# EAGLE schematic main-board (EAGLE 9.6.2)
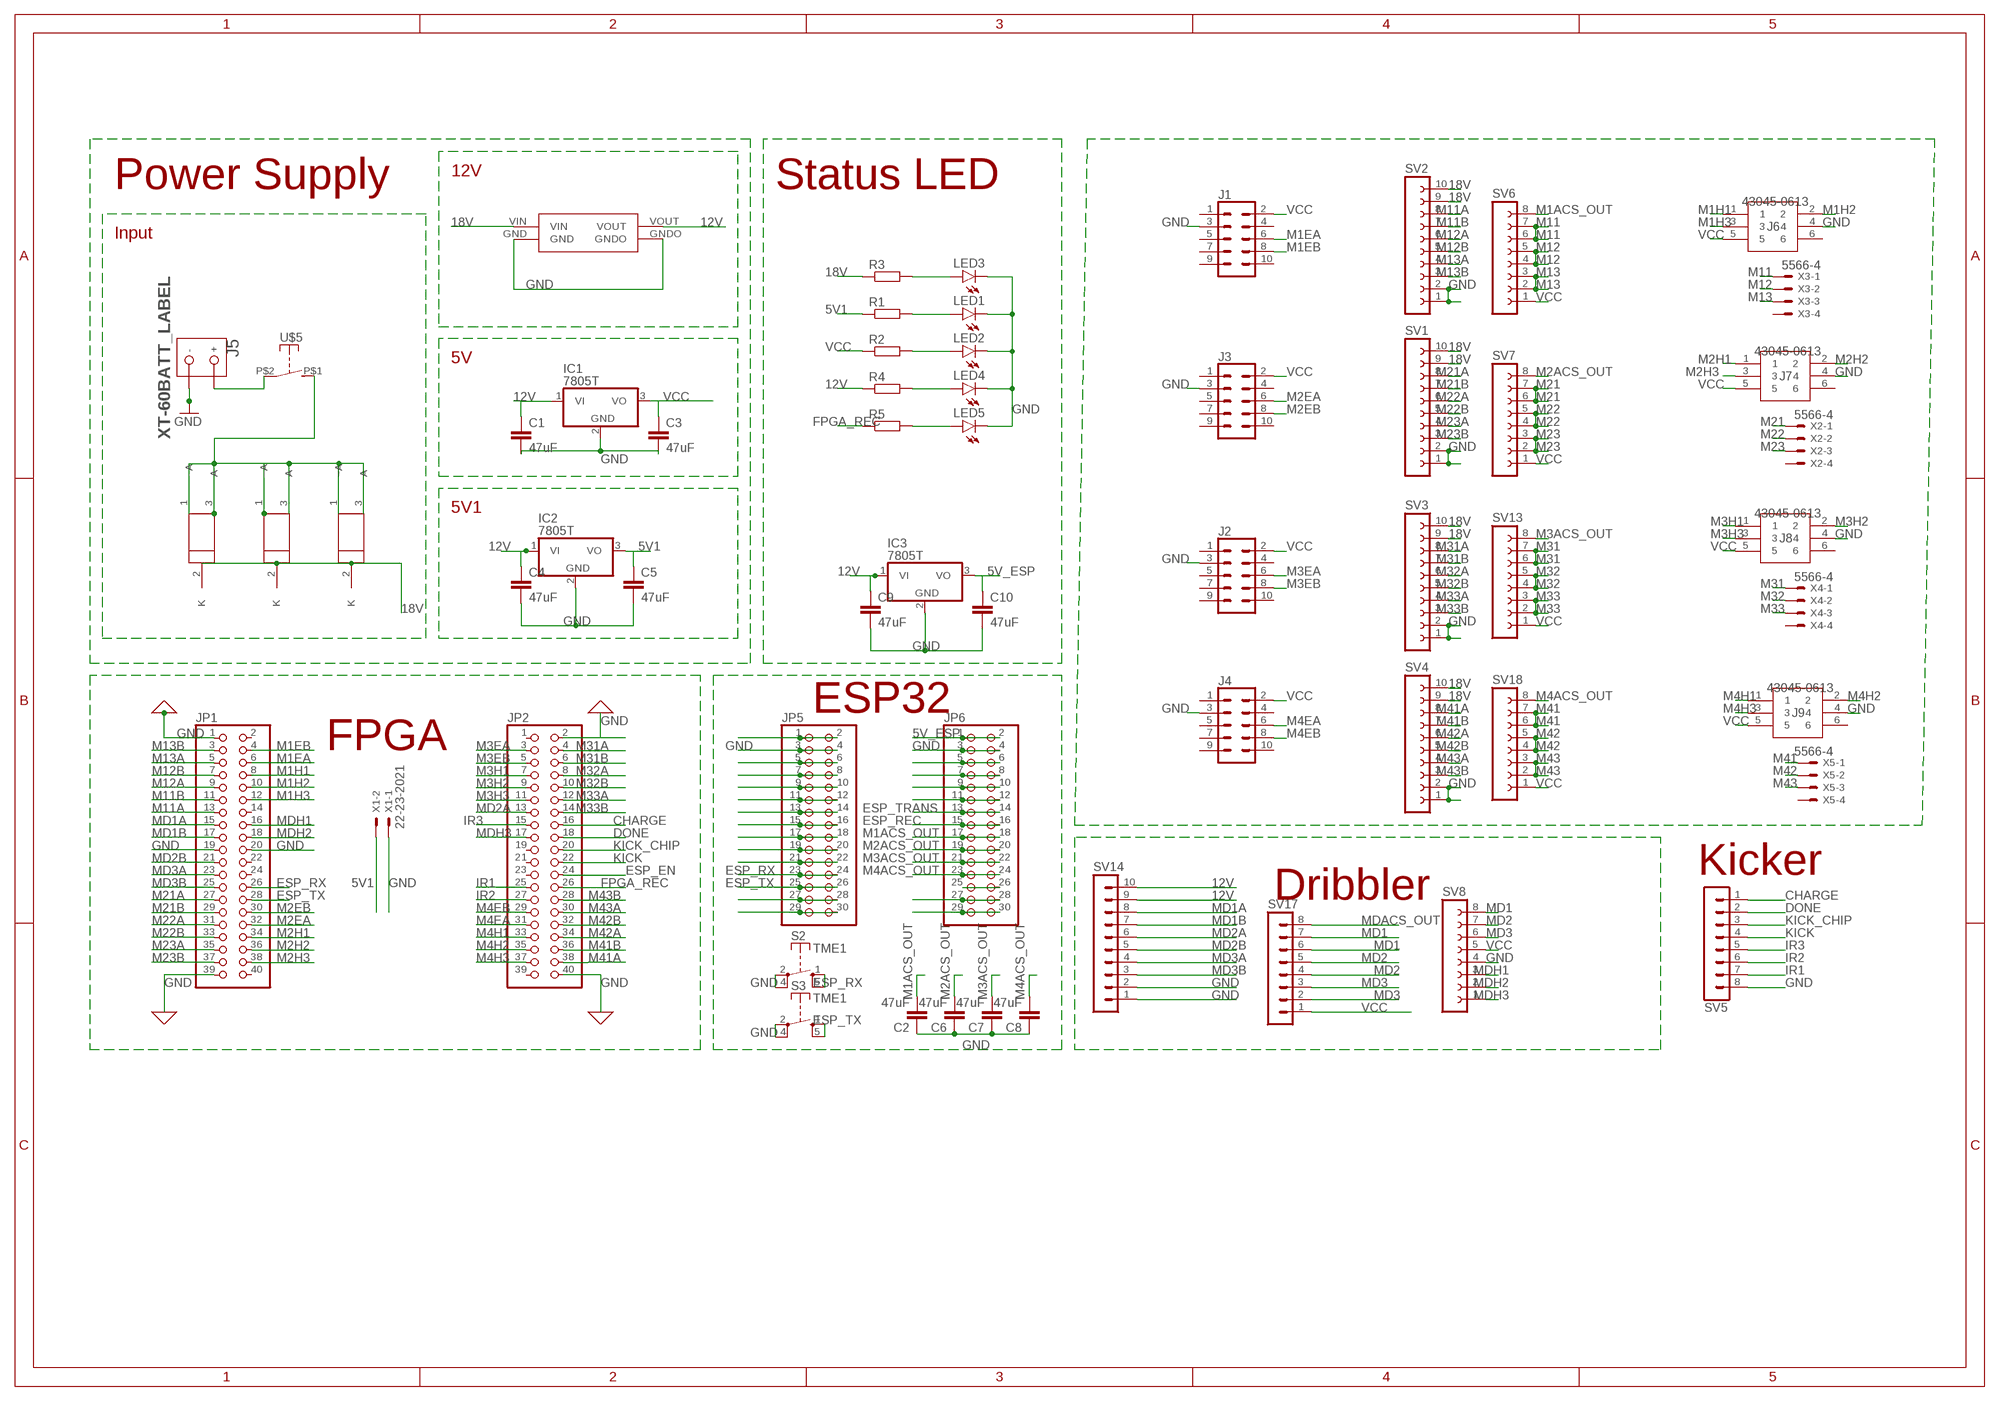
[diagram p0: schematic, sheet 1]

## Parts
C1  47uF  C-EUC1206  [C1206]
C2  47uF  C-EUC1206  [C1206]
C3  47uF  C-EUC1206  [C1206]
C4  47uF  C-EUC1206  [C1206]
C5  47uF  C-EUC1206  [C1206]
C6  47uF  C-EUC1206  [C1206]
C7  47uF  C-EUC1206  [C1206]
C8  47uF  C-EUC1206  [C1206]
C9  47uF  C-EUC1206  [C1206]
C10  47uF  C-EUC1206  [C1206]
IC1  7805T  [TO220H]
IC2  7805T  [TO220H]
IC3  7805T  [TO220H]
J1  CONN_05X2SHD_LOCK  [2X5-SHROUDED_LOCK]
J2  CONN_05X2SHD_LOCK  [2X5-SHROUDED_LOCK]
J3  CONN_05X2SHD_LOCK  [2X5-SHROUDED_LOCK]
J4  CONN_05X2SHD_LOCK  [2X5-SHROUDED_LOCK]
J5  XT-60BATT_LABEL  [XT-60]
J6  43045-0613  [43045-0613]
J7  43045-0613  [43045-0613]
J8  43045-0613  [43045-0613]
J9  43045-0613  [43045-0613]
JP1  PINHD-2X20  [2X20]
JP2  PINHD-2X20  [2X20]
JP5  PINHD-2X15  [2X15]
JP6  PINHD-2X15  [2X15]
LED1  LEDSMT1206  [1206]
LED2  LEDSMT1206  [1206]
LED3  LEDSMT1206  [1206]
LED4  LEDSMT1206  [1206]
LED5  LEDSMT1206  [1206]
R1  R-EU_R1206  [R1206]
R2  R-EU_R1206  [R1206]
R3  R-EU_R1206  [R1206]
R4  R-EU_R1206  [R1206]
R5  R-EU_R1206  [R1206]
S2  TME1  [TME1]
S3  TME1  [TME1]
SV1  FE10-1  [FE10]
SV2  FE10-1  [FE10]
SV3  FE10-1  [FE10]
SV4  FE10-1  [FE10]
SV5  MA08-1  [MA08-1]
SV6  FE08-1  [FE08]
SV7  FE08-1  [FE08]
SV8  FE08-1  [FE08]
SV13  FE08-1  [FE08]
SV14  MA10-1  [MA10-1]
SV17  MA08-1  [MA08-1]
SV18  FE08-1  [FE08]
U1  LP38690DT-3.3  [TO228P1042X238-3N]
U2  LP38690DT-3.3  [TO228P1042X238-3N]
U3  LP38690DT-3.3  [TO228P1042X238-3N]
U$4  BUCK  [BUCK]
U$5  SWITCH_DA10  [DA10]
X1  22-23-2021  [22-23-2021]
X2  5566-4  [5566-4]
X3  5566-4  [5566-4]
X4  5566-4  [5566-4]
X5  5566-4  [5566-4]

## Nets
5V1 [5v]: C5.1 IC2.3(VO) R1.1 X1.2
5V_ESP [5v]: C10.1 IC3.3(VO) JP6.1 JP6.2
12V [18V]: C1.1 C4.1 C9.1 IC1.1(VI) IC2.1(VI) IC3.1(VI) R4.1 SV14.9 SV14.10 U$4.VOUT
18V [18V]: R3.1 SV1.9 SV1.10 SV2.9 SV2.10 SV3.9 SV3.10 SV4.9 SV4.10 U1.2(K) U2.2(K) U3.2(K) U$4.VIN
CHARGE [signal]: JP2.16 SV5.1
DONE [signal]: JP2.18 SV5.2
ESP_EN [signal]: JP2.24
ESP_REC [signal]: JP6.15 JP6.16
ESP_RX [signal]: JP1.26 JP5.23 JP5.24 S2.1(S) S2.5(S)
ESP_TRANS [signal]: JP6.13 JP6.14
ESP_TX [signal]: JP1.28 JP5.25 JP5.26 S3.1(S) S3.5(S)
FPGA_REC [signal]: JP2.26 R5.1
GND [gnd]: C1.2 C2.1 C3.2 C4.2 C5.2 C6.1 C7.1 C8.1 C9.2 C10.2 IC1.2(GND) IC2.2(GND) IC3.2(GND) J1.3 J2.3 J3.3 J4.3 J5.GND(-) J6.4 J7.4 J8.4 J9.4 JP1.1 JP1.19 JP1.20 JP1.39 JP2.2 JP2.40 JP5.3 JP5.4 JP6.3 JP6.4 LED1.C LED2.C LED3.C LED4.C LED5.C S2.2(P) S2.4(P) S3.2(P) S3.4(P) SV1.1 SV1.2 SV2.1 SV2.2 SV3.1 SV3.2 SV4.1 SV4.2 SV5.8 SV8.4 SV14.1 SV14.2 U$4.GND U$4.GNDO X1.1
INPUT [VCKT]: U1.1(~A) U1.3(A) U2.1(~A) U2.3(A) U3.1(~A) U3.3(A) U$5.P$1(S)
IR1 [signal]: JP2.25 SV5.7
IR2 [signal]: JP2.27 SV5.6
IR3 [signal]: JP2.15 SV5.5
KICK [signal]: JP2.22 SV5.4
KICK_CHIP [signal]: JP2.20 SV5.3
M1ACS_OUT [signal]: C2.2 JP6.17 JP6.18 SV6.8
M1EA [signal]: J1.6 JP1.6
M1EB [signal]: J1.8 JP1.4
M1H1 [signal]: J6.1 JP1.8
M1H2 [signal]: J6.2 JP1.10
M1H3 [signal]: J6.3 JP1.12
M2ACS_OUT [signal]: C6.2 JP6.19 JP6.20 SV7.8
M2EA [signal]: J3.6 JP1.32
M2EB [signal]: J3.8 JP1.30
M2H1 [signal]: J7.1 JP1.34
M2H2 [signal]: J7.2 JP1.36
M2H3 [signal]: J7.3 JP1.38
M3ACS_OUT [signal]: C7.2 JP6.21 JP6.22 SV13.8
M3EA [signal]: J2.6 JP2.3
M3EB [signal]: J2.8 JP2.5
M3H1 [signal]: J8.1 JP2.7
M3H2 [signal]: J8.2 JP2.9
M3H3 [signal]: J8.3 JP2.11
M4ACS_OUT [signal]: C8.2 JP6.23 JP6.24 SV18.8
M4EA [signal]: J4.6 JP2.31
M4EB [signal]: J4.8 JP2.29
M4H1 [signal]: J9.1 JP2.33
M4H2 [signal]: J9.2 JP2.35
M4H3 [signal]: J9.3 JP2.37
M11 [motor]: SV6.6 SV6.7 X3.1
M11A [signal]: JP1.13 SV2.8
M11B [signal]: JP1.11 SV2.7
M12 [motor]: SV6.4 SV6.5 X3.2
M12A [signal]: JP1.9 SV2.6
M12B [signal]: JP1.7 SV2.5
M13 [motor]: SV6.2 SV6.3 X3.3
M13A [signal]: JP1.5 SV2.4
M13B [signal]: JP1.3 SV2.3
M21 [motor]: SV7.6 SV7.7 X2.1
M21A [signal]: JP1.27 SV1.8
M21B [signal]: JP1.29 SV1.7
M22 [motor]: SV7.4 SV7.5 X2.2
M22A [signal]: JP1.31 SV1.6
M22B [signal]: JP1.33 SV1.5
M23 [motor]: SV7.2 SV7.3 X2.3
M23A [signal]: JP1.35 SV1.4
M23B [signal]: JP1.37 SV1.3
M31 [motor]: SV13.6 SV13.7 X4.1
M31A [signal]: JP2.4 SV3.8
M31B [signal]: JP2.6 SV3.7
M32 [motor]: SV13.4 SV13.5 X4.2
M32A [signal]: JP2.8 SV3.6
M32B [signal]: JP2.10 SV3.5
M33 [motor]: SV13.2 SV13.3 X4.3
M33A [signal]: JP2.12 SV3.4
M33B [signal]: JP2.14 SV3.3
M41 [motor]: SV18.6 SV18.7 X5.1
M41A [signal]: JP2.38 SV4.8
M41B [signal]: JP2.36 SV4.7
M42 [motor]: SV18.4 SV18.5 X5.2
M42A [signal]: JP2.34 SV4.6
M42B [signal]: JP2.32 SV4.5
M43 [motor]: SV18.2 SV18.3 X5.3
M43A [signal]: JP2.30 SV4.4
M43B [signal]: JP2.28 SV4.3
MD1 [motor]: SV8.8 SV17.6 SV17.7
MD1A [signal]: JP1.15 SV14.8
MD1B [signal]: JP1.17 SV14.7
MD2 [motor]: SV8.7 SV17.4 SV17.5
MD2A [signal]: JP2.13 SV14.6
MD2B [signal]: JP1.21 SV14.5
MD3 [motor]: SV8.6 SV17.2 SV17.3
MD3A [signal]: JP1.23 SV14.4
MD3B [signal]: JP1.25 SV14.3
MDACS_OUT: SV17.8
MDH1 [signal]: JP1.16 SV8.3
MDH2 [signal]: JP1.18 SV8.2
MDH3 [signal]: JP2.17 SV8.1
N$1: JP5.1 JP5.2
N$4: LED1.A R1.2
N$6: JP5.5 JP5.6
N$7: LED2.A R2.2
N$8: JP5.7 JP5.8
N$9: JP5.9 JP5.10
N$10: LED3.A R3.2
N$11: JP5.11 JP5.12
N$12: JP5.13 JP5.14
N$13: LED4.A R4.2
N$14: JP5.15 JP5.16
N$15: JP5.17 JP5.18
N$16: LED5.A R5.2
N$17: JP5.19 JP5.20
N$18: JP5.21 JP5.22
N$23: JP5.27 JP5.28
N$24: JP5.29 JP5.30
N$27: JP6.5 JP6.6
N$28: JP6.7 JP6.8
N$29: JP6.9 JP6.10
N$30: JP6.11 JP6.12
N$38: JP6.27 JP6.28
N$39: JP6.29 JP6.30
N$41: JP6.25 JP6.26
SUPP [VCKT]: J5.BATT(+) U$5.P$2(P)
VCC: C3.1 IC1.3(VO) J1.2 J2.2 J3.2 J4.2 J6.5 J7.5 J8.5 J9.5 R2.1 SV6.1 SV7.1 SV8.5 SV13.1 SV17.1 SV18.1
Unconnected: J1.1 J1.4 J1.5 J1.7 J1.9 J1.10 J2.1 J2.4 J2.5 J2.7 J2.9 J2.10 J3.1 J3.4 J3.5 J3.7 J3.9 J3.10 J4.1 J4.4 J4.5 J4.7 J4.9 J4.10 J6.6 J7.6 J8.6 J9.6 JP1.2 JP1.14 JP1.22 JP1.24 JP1.40 JP2.1 JP2.19 JP2.21 JP2.23 JP2.39 X2.4 X3.4 X4.4 X5.4

## Notes on the sheet
- 12V
- Power Supply | Status LED
- Input
- 5V
- 5V1
- ESP32
- FPGA
- Kicker
- Dribbler

## Library data of the parts
C1-C10 = rcl:C-EU: CAPACITOR, European symbol
IC1-IC3 = linear:78*: Positive VOLTAGE REGULATOR Source: http://cache.national.com/ds/LM/LM78L05.pdf http://www.fairchildsemi.com/ds/LM/LM7805.pdf
J1-J4 = SparkFun-Connectors:CONN_05X2: Multi connection point. Often used as Generic Header-pin footprint for 0.1 inch spaced/style header connections For AVR SPI programming port, see special device with nice symbol: "AVR_SPI_PROG_5x2.dev" You can populate with any combo of single row headers, but if you'd like an exact match, check these: 2x5 AVR ICSP Male Header <https://www.sparkfun.com/products/778> (PRT-00778) 2x5 Pin Shrouded Header <https://www.sparkfun.com/products/8506> (PRT-08506) On any of the 0.1 inch spaced packages, you can populate with these: Break Away Headers - Straight <https://www.sparkfun.com/products/116> (PRT-00116) Break Away Male Headers - Right Angle <https://www.sparkfun.com/products/553> (PRT-00553) Female Headers <https://www.sparkfun.com/products/115> (PRT-00115) Break Away Headers - Machine Pin <https://www.sparkfun.com/products/117> (PRT-00117) Break Away Female Headers - Swiss Machine Pin <https://www.sparkfun.com/products/743> (PRT-00743) Special note: the shrouded connector mates well with our 5x2 ribbon cables: 2x5 Pin IDC Ribbon Cable <https://www.sparkfun.com/products/8535> (PRT-08535); PROD_ID: CONN-08671; SF_ID: PRT-08506
J5 = RoboJackets-Connectors:XT-60: XT-60 Power Connector Distributor: HobbyKing <http://www.hobbyking.com/hobbyking/store/RC_PRODUCT_SEARCH.asp?strSearch=xt-60>
J6-J9 = 43045-0613:43045-0613: Header 3.00mm, WTB, dual row, vert,6w Molex MICRO-FIT 3.0 Series, Series Number 43045, 3mm Pitch 6 Way 2 Row Straight PCB Header, Solder Termination, 5A Source: Datasheet <http://uk.rs-online.com/webdocs/150e/0900766b8150e466.pdf>; ALLIED_NUMBER: 70090681; ALLIED_PRICE-STOCK: http://www.alliedelec.com/molex-incorporated-43045-0613/70090681/; DESCRIPTION: Header 3.00mm, WTB, dual row, vert,6w Molex MICRO-FIT 3.0 Series, Series Number 43045, 3mm Pitch 6 Way 2 Row Straight PCB Header, Solder Termination, 5A; HEIGHT: mm; MANUFACTURER_NAME: Molex; MANUFACTURER_PART_NUMBER: 43045-0613; MOUSER_PART_NUMBER: 538-43045-0613; MOUSER_PRICE-STOCK: https://www.mouser.com/Search/Refine.aspx?Keyword=538-43045-0613; RS_PART_NUMBER: 6700377P; RS_PRICE-STOCK: http://uk.rs-online.com/web/p/products/6700377P
JP1 JP2 = pinhead:PINHD-2X20: PIN HEADER
JP5 JP6 = pinhead:PINHD-2X15: PIN HEADER
LED1-LED5 = led:LED: LED OSRAM: - CHIPLED LG R971, LG N971, LY N971, LG Q971, LY Q971, LO R971, LY R971 LH N974, LH R974 LS Q976, LO Q976, LY Q976 LO Q996 - Hyper CHIPLED LW Q18S LB Q993, LB Q99A, LB R99A - SideLED LS A670, LO A670, LY A670, LG A670, LP A670 LB A673, LV A673, LT A673, LW A673 LH A674 LY A675 LS A676, LA A676, LO A676, LY A676, LW A676 LS A679, LY A679, LG A679 - Hyper Micro SIDELED® LS Y876, LA Y876, LO Y876, LY Y876 LT Y87S - SmartLED LW L88C, LW L88S LB L89C, LB L89S, LG L890 LS L89K, LO L89K, LY L89K LS L896, LA L896, LO L896, LY L896 - TOPLED LS T670, LO T670, LY T670, LG T670, LP T670 LSG T670, LSP T670, LSY T670, LOP T670, LYG T670 LG T671, LOG T671, LSG T671 LB T673, LV T673, LT T673, LW T673 LH T674 LS T676, LA T676, LO T676, LY T676, LB T676, LH T676, LSB T676, LW T676 LB T67C, LV T67C, LT T67C, LS T67K, LO T67K, LY T67K, LW E67C LS E67B, LA E67B, LO E67B, LY E67B, LB E67C, LV E67C, LT E67C LW T67C LS T679, LY T679, LG T679 LS T770, LO T770, LY T770, LG T770, LP T770 LB T773, LV T773, LT T773, LW T773 LH T774 LS E675, LA E675, LY E675, LS T675 LS T776, LA T776, LO T776, LY T776, LB T776 LHGB T686 LT T68C, LB T68C - Hyper Mini TOPLED® LB M676 - Mini TOPLED Santana® LG M470 LS M47K, LO M47K, LY M47K Source: http://www.osram.convergy.de LUXEON: - LUMILED® LXK2-PW12-R00, LXK2-PW12-S00, LXK2-PW14-U00, LXK2-PW14-V00 LXK2-PM12-R00, LXK2-PM12-S00, LXK2-PM14-U00 LXK2-PE12-Q00, LXK2-PE12-R00, LXK2-PE12-S00, LXK2-PE14-T00, LXK2-PE14-U00 LXK2-PB12-K00, LXK2-PB12-L00, LXK2-PB12-M00, LXK2-PB14-N00, LXK2-PB14-P00, LXK2-PB14-Q00 LXK2-PR12-L00, LXK2-PR12-M00, LXK2-PR14-Q00, LXK2-PR14-R00 LXK2-PD12-Q00, LXK2-PD12-R00, LXK2-PD12-S00 LXK2-PH12-R00, LXK2-PH12-S00 LXK2-PL12-P00, LXK2-PL12-Q00, LXK2-PL12-R00 Source: www.luxeon.com KINGBRIGHT: KA-3528ASYC Source: www.kingbright.com
R1-R5 = resistor:R-EU_: RESISTOR, European symbol
S2 S3 = switch-misc:TME1: SWITCH
SV1-SV4 = con-lsta:FE10-1: FEMALE HEADER; OC_FARNELL: unknown; OC_NEWARK: unknown
SV5 SV17 = con-lstb:MA08-1: PIN HEADER; OC_FARNELL: unknown; OC_NEWARK: unknown
SV6-SV8 SV13 SV18 = con-lsta:FE08-1: FEMALE HEADER; OC_FARNELL: unknown; OC_NEWARK: unknown
SV14 = con-lstb:MA10-1: PIN HEADER; OC_FARNELL: unknown; OC_NEWARK: unknown
U1-U3 = LP38690DT-3.3:LP38690DT-3.3; MPN: LP38690DT-3.3; OC_FARNELL: 1008048; OC_NEWARK: 41K7439; PACKAGE: TO-252; SUPPLIER: National Semiconductor
U$4 = BUCK:BUCK
U$5 = switch_DA10:SWITCH_DA10
X1 = con-molex:22-23-2021: .100" (2.54mm) Center Header - 2 Pin; MF: MOLEX; MPN: 22-23-2021; OC_FARNELL: 1462926; OC_NEWARK: 25C3832
X2-X5 = con-molex:5566-4: Mini FIT connector 4 pol Source: http://www.molex.com; MF: MOLEX; OC_FARNELL: unknown; OC_NEWARK: unknown

## Net classes
0 signal1: width 0.3 mm, drill 0.4 mm, clearance 0.2 mm
1 5v: width 0.4 mm, drill 0.4 mm, clearance 0.2 mm
2 18V: width 1.2 mm, drill 1.3 mm, clearance 0.2 mm
3 signal: width 0.3 mm, drill 0.4 mm, clearance 0.2 mm
4 gnd: width 0.3 mm, drill 0.4 mm, clearance 0.2 mm
5 VCKT: width 4 mm, drill 4 mm, clearance 0.2 mm
6 motor: width 0.8 mm, drill 1 mm, clearance 0.2 mm